# EAGLE design NixieClock (EAGLE 6.6.0)
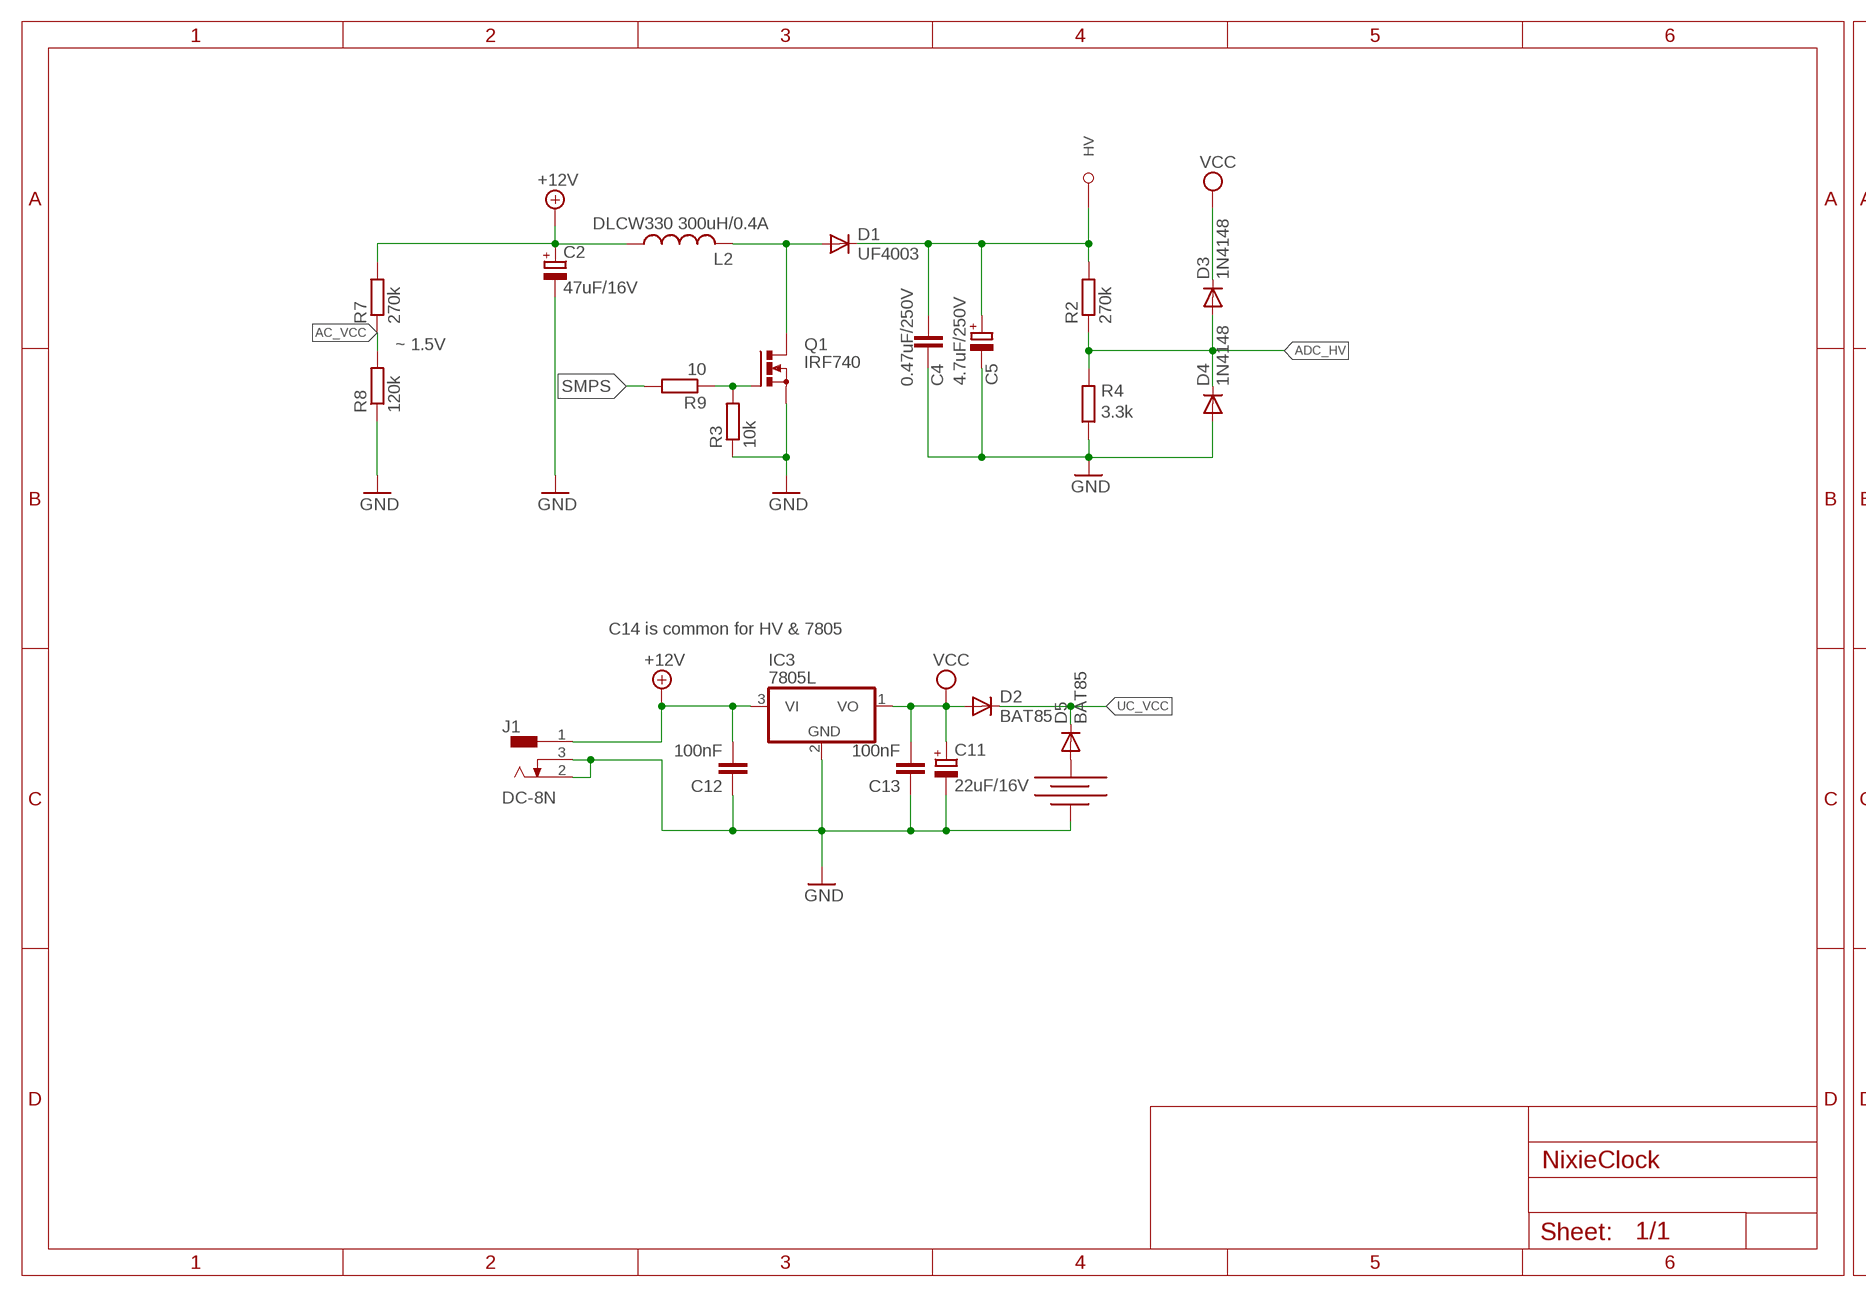
[diagram p0: schematic, sheet 1, part 1 of 2]
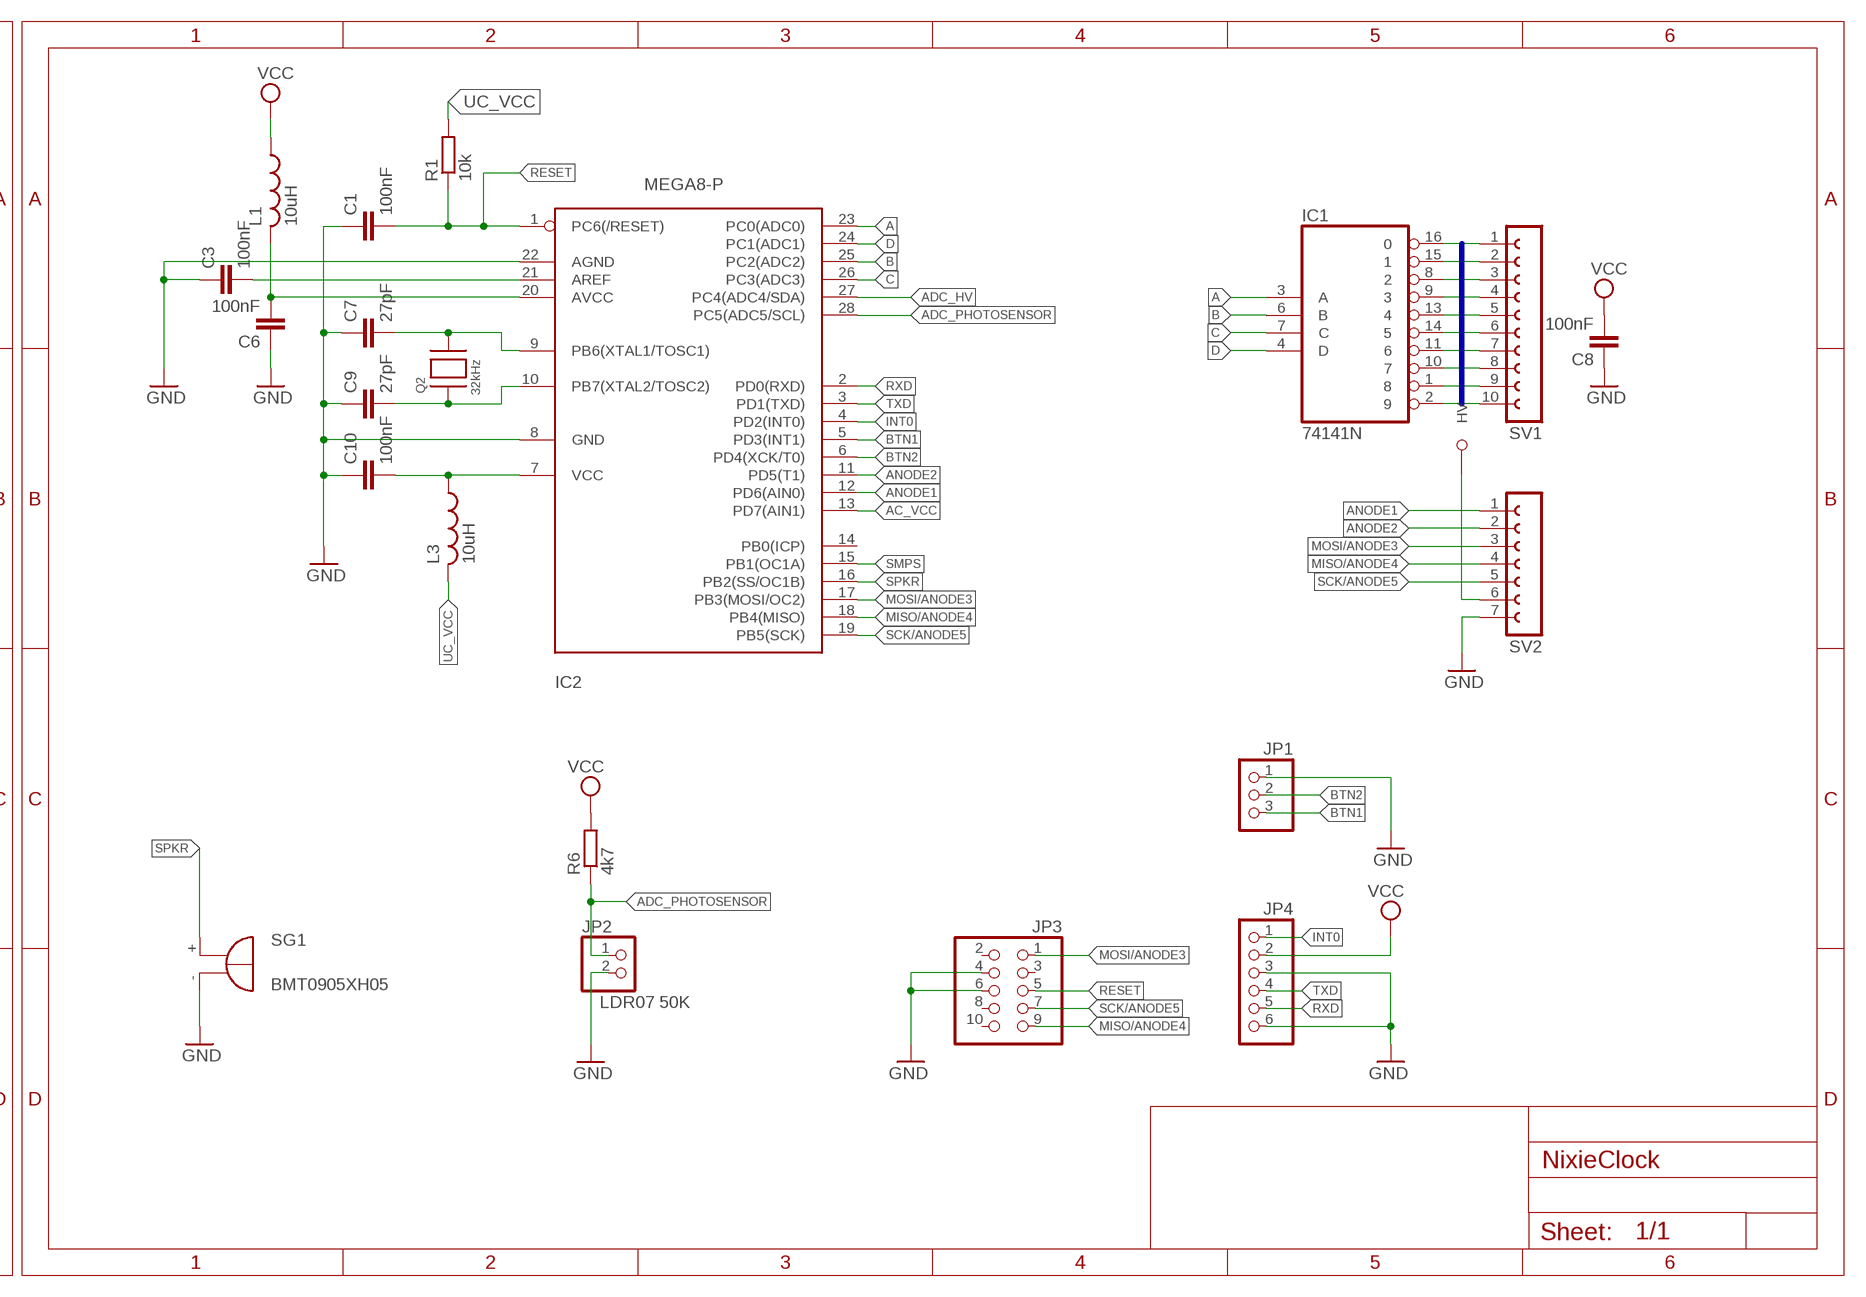
[diagram p1: schematic, sheet 1, part 2 of 2]

## Parts
C1  100nF  C-EU025-025X050  [C025-025X050]
C2  47uF/16V  CPOL-EUE2.5-7  [E2,5-7]
C3  100nF  C-EU025-025X050  [C025-025X050]
C4  0.47uF/250V  C10/6  [C10B6]
C5  4.7uF/250V  CPOL-EU  [CAP_RADIAL]
C6  100nF  C-EU025-025X050  [C025-025X050]
C7  27pF  C-EU025-025X050  [C025-025X050]
C8  100nF  C-EU050-025X075  [C050-025X075]
C9  27pF  C-EU025-025X050  [C025-025X050]
C10  100nF  C-EU025-025X050  [C025-025X050]
C11  22uF/16V  CPOL-EUE2.5-6  [E2,5-6]
C12  100nF  C-EU025-025X050  [C025-025X050]
C13  100nF  C-EU025-025X050  [C025-025X050]
D1  UF4003  [DO41-10]
D2  BAT85  1N4148DO35-7  [DO35-7]
D3  1N4148  1N4148DO35-7  [DO35-7]
D4  1N4148  1N4148DO35-7  [DO35-7]
D5  BAT85  1N4148DO35-7  [DO35-7]
IC1  74141N  [DIL16]
IC2  MEGA8-P  [DIL28-3]
IC3  7805L  [TO92]
J1  DC-8N  [DC-8N]
JP1  PINHD-1X3/90  [1X03/90]
JP2  LDR07 50K  PINHD-1X2  [1X02]
JP3  PINHD-2X5/90  [2X05/90]
JP4  PINHD-1X6/90  [1X06/90]
L1  10uH  L-US0204/7  [0204/7]
L2  DLCW330 300uH/0.4A  RADIAL-CHOKE4MM  [MURATA-CHOKE-7-4]
L3  10uH  L-US0204/5  [0204/5]
Q1  IRF740  PMOSFET_NTO220BH  [TO220BH]
Q2  32kHz  XTAL  [QS]
R1  10k  R-EU_0207/12  [0207/12]
R2  270k  R-EU_0204/5  [0204/5]
R3  10k  R-EU_0204/5  [0204/5]
R4  3.3k  R-EU_0204/5  [0204/5]
R6  4k7  R-EU_0204/5  [0204/5]
R7  270k  R-EU_0204/5  [0204/5]
R8  120k  R-EU_0204/5  [0204/5]
R9  10  R-EU_0204/5  [0204/5]
SG1  BMT0905XH05  [BMT0905XH05]
SV1  FE10-1  [FE10]
SV2  FE07-1  [FE07]
U$3  BAT1220THT  [1220]

## Nets
+12V: C2.+ C12.2 IC3.3(VI) J1.1 L2.P$1 R7.2
A: IC1.3(A) IC2.23(PC0(ADC0))
AC_VCC: IC2.13(PD7(AIN1)) R7.1 R8.2
ADC_HV: D3.A D4.C IC2.27(PC4(ADC4/SDA)) R2.1 R4.2
ADC_PHOTOSENSOR: IC2.28(PC5(ADC5/SCL)) JP2.1 R6.1
ANODE1: IC2.12(PD6(AIN0)) SV2.1
ANODE2: IC2.11(PD5(T1)) SV2.2
B: IC1.6(B) IC2.25(PC2(ADC2))
BTN1: IC2.5(PD3(INT1)) JP1.3
BTN2: IC2.6(PD4(XCK/T0)) JP1.2
C: IC1.7(C) IC2.26(PC3(ADC3))
D: IC1.4(D) IC2.24(PC1(ADC1))
D1: IC1.2 SV1.1
D2: IC1.1 SV1.2
D3: IC1.16 SV1.3
D4: IC1.15 SV1.4
D5: IC1.14 SV1.5
D6: IC1.13 SV1.6
D7: IC1.11 SV1.7
D8: IC1.10 SV1.8
D9: IC1.9 SV1.9
D10: IC1.8 SV1.10
GND: C1.1 C2.- C3.1 C4.2 C5.P$4(-) C6.1 C7.1 C8.1 C9.1 C10.1 C11.- C12.1 C13.1 D4.A IC2.8(GND) IC2.22(AGND) IC3.2(GND) J1.2 J1.3 JP1.1 JP2.2 JP3.4 JP3.6 JP4.3 JP4.6 Q1.S R3.1 R4.1 R8.1 SG1.- SV2.7 U$3.-
HV: C4.1 C5.P$3(+) D1.C R2.2 SV2.6
INT0: IC2.4(PD2(INT0)) JP4.1
MISO/ANODE4: IC2.18(PB4(MISO)) JP3.9 SV2.4
MOSI/ANODE3: IC2.17(PB3(MOSI/OC2)) JP3.1 SV2.3
N$1: C7.2 IC2.9(PB6(XTAL1/TOSC1)) Q2.P$2
N$2: C9.2 IC2.10(PB7(XTAL2/TOSC2)) Q2.P$1
N$3: D5.A U$3.+
N$4: Q1.G R3.2 R9.1
N$9: C6.2 IC2.20(AVCC) L1.2
N$10: C10.2 IC2.7(VCC) L3.1
N$11: C3.2 IC2.21(AREF)
N$16: D1.A L2.P$2 Q1.D
RESET: C1.2 IC2.1(PC6(/RESET)) JP3.5 R1.1
RXD: IC2.2(PD0(RXD)) JP4.5
SCK/ANODE5: IC2.19(PB5(SCK)) JP3.7 SV2.5
SMPS: IC2.15(PB1(OC1A)) R9.2
SPKR: IC2.16(PB2(SS/OC1B)) SG1.+
TXD: IC2.3(PD1(TXD)) JP4.4
UC_VCC: D2.C D5.C L3.2 R1.2
VCC: C8.2 C11.+ C13.2 D2.A D3.C IC3.1(VO) JP4.2 L1.1 R6.2
Unconnected: IC2.14(PB0(ICP)) JP3.2 JP3.3 JP3.8 JP3.10

## Buses
D[1..10]

## Notes on the sheet
- ~ 1.5V
- C14 is common for HV & 7805

## Power pins joined to a net without a drawn wire
GND: IC1.12(GND)
VCC: IC1.5(VCC)

## Library data of the parts
C1 C3 C6-C10 C12 C13 = rcl:C-EU: CAPACITOR, European symbol
C2 C11 = rcl:CPOL-EU: POLARIZED CAPACITOR, European symbol
C4 = capacitor-wima:C: CAPACITOR naming: grid - package width
C5 = Various:CPOL-EU: POLARIZED CAPACITOR, European symbol
D1 = diode:UF4003: DIODE ultrafast recovery diode, 200 V rectifier
D2-D5 = diode:1N4148: DIODE high speed (Philips)
IC1 = 74xx-eu:74*141: BCD to decimal DECODER/DRIVER
IC2 = atmel:MEGA8-P: MICROCONTROLLER 8 Kbytes FLASH 1 kbytes SRAM 512 bytes EEPROM USART 4-channel 10 bit ADC 2-channel 8 bit ADC Source: avr.lbr
IC3 = linear:78*: Positive VOLTAGE REGULATOR Source: http://cache.national.com/ds/LM/LM78L05.pdf http://www.fairchildsemi.com/ds/LM/LM7805.pdf
J1 = con-jack-2:DC-8N: DC-8N NARROW DC POWER SOCKET Source: FC681455.pdf; OC_FARNELL: unknown; OC_NEWARK: unknown; OC_TME: FC681455
JP1 = pinhead:PINHD-1X3: PIN HEADER
JP2 = pinhead:PINHD-1X2: PIN HEADER
JP3 = pinhead:PINHD-2X5: PIN HEADER
JP4 = pinhead:PINHD-1X6: PIN HEADER
L1 L3 = rcl:L-US: INDUCTOR, American symbol
L2 = WB:RADIAL-CHOKE: Murata Power Solutions
Q1 = transistor-power:PMOSFET_N: Power MOSFET N-Channel
Q2 = Various:XTAL
R1-R4 R6-R9 = rcl:R-EU_: RESISTOR, European symbol
SG1 = Various:BMT0905XH05: MAGNETIC TRANSDUCER Source: Http:www.be-star.com; OC_FARNELL: unknown; OC_NEWARK: unknown
SV1 = con-lsta:FE10-1: FEMALE HEADER; OC_FARNELL: unknown; OC_NEWARK: unknown
SV2 = con-lsta:FE07-1: FEMALE HEADER; OC_FARNELL: unknown; OC_NEWARK: unknown
U$3 = WB:BAT1220THT: Based on CH23-1220LF drawing

## Board
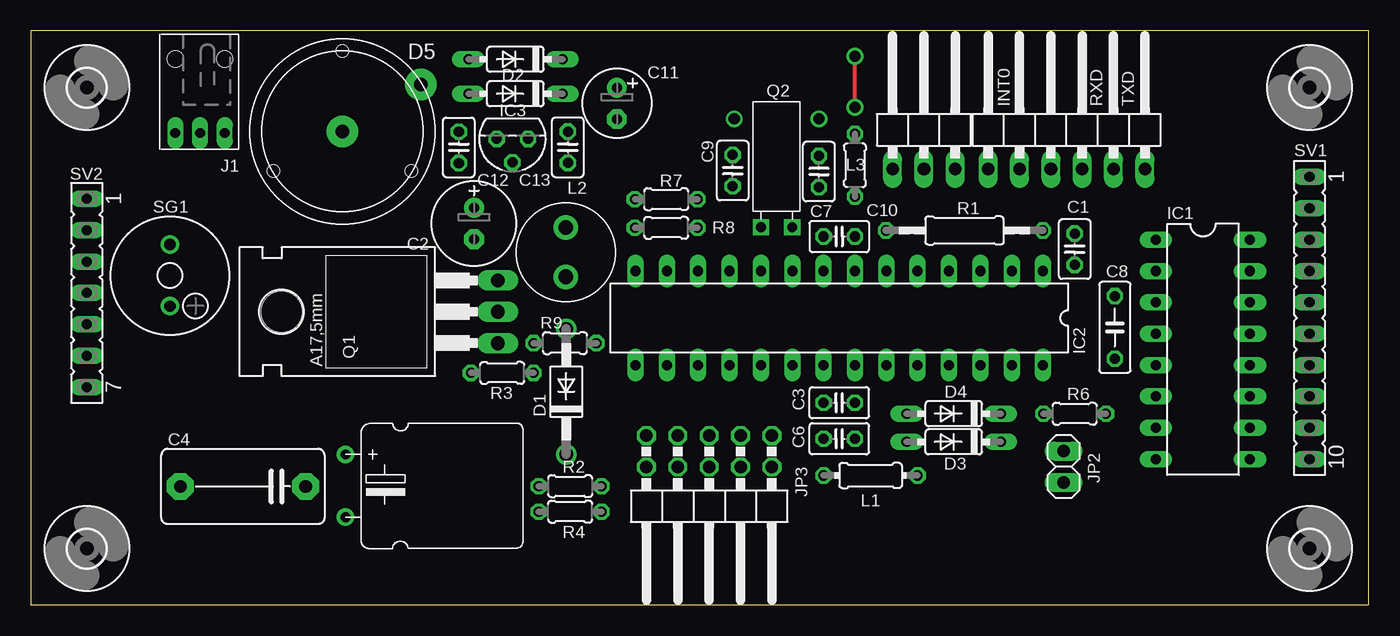
[diagram p2: board, top side]
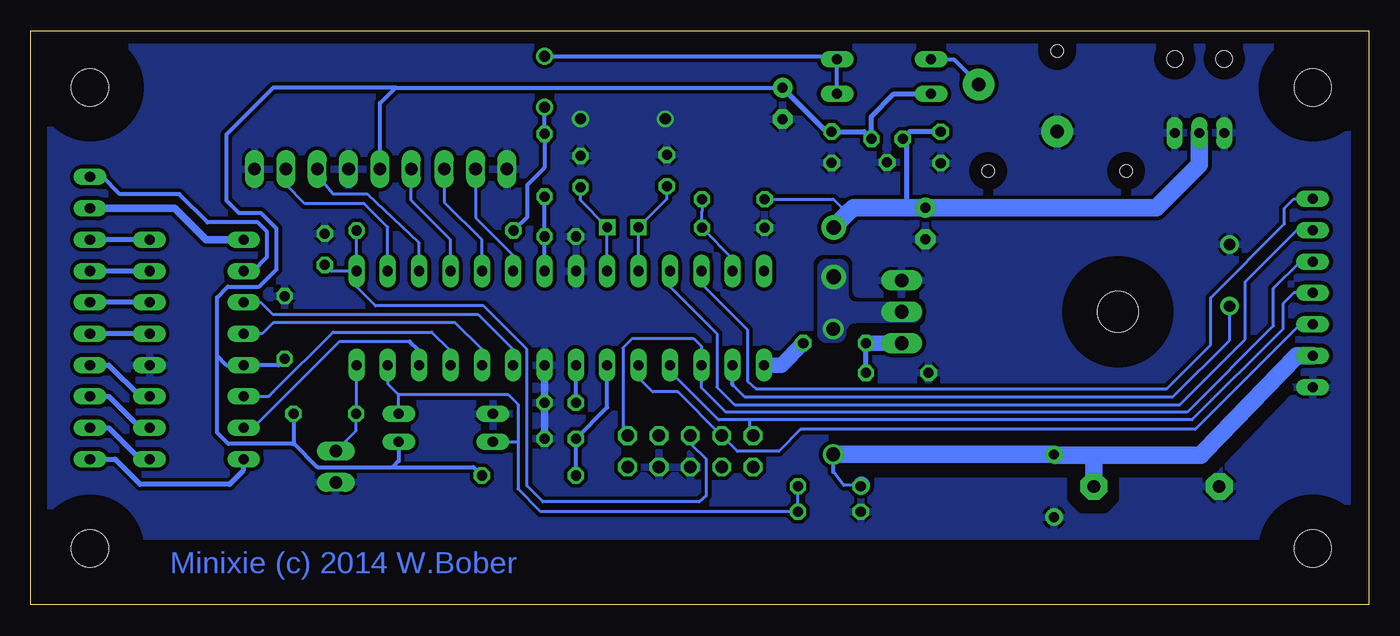
[diagram p3: board, bottom side, seen from below]

Size 108.38 x 46.49 mm. Coordinates in mm from the lower left corner, seen from the top.
Outline: 0,0 108.38,0 108.38,46.49 0,46.49 0,0
Copper layers (1*16): Top 0.035mm / dielectric 1.5mm / Bottom 0.035mm
Design rules "default": minimum track width 10mil, minimum drill 24mil, track to track 12mil, track to pad 12mil, pad to pad 12mil, via to via 12mil, smd to smd 8mil, copper to edge 40mil, drill to drill 8mil, minimum pad ring 10mil, minimum via ring 8mil, stop-mask expansion 4mil, vias tented up to drill 0mil, thermal gap 10mil
bRestrict: 8 lines

### Footprints (pad centres in the part's own frame; a part is rotated, then mirrored left to right if it is on the bottom)
C025-025X050 = drill 0.813 octagon: 1 -1.27,0; 2 1.27,0
E2,5-7 = drill 0.813 pad 1.6: + -1.27,0 | drill 0.813 pad 1.6 octagon: - 1.27,0
C10B6 = drill 1.016 pad 2.159 octagon: 1 -5.08,0; 2 5.08,0
CAP_RADIAL = drill 0.8 pad 1.422: P$3 0,-2.54; P$4 0,2.54
C050-025X075 = drill 0.813 octagon: 1 -2.54,0; 2 2.54,0
E2,5-6 = drill 0.813 pad 1.6: + -1.27,0 | drill 0.813 pad 1.6 octagon: - 1.27,0
DO41-10 = drill 1.118: A 5.08,0; C -5.08,0
DO35-7 = drill 0.813 long: A 3.81,0; C -3.81,0
DIL16 = drill 0.813 long: 1 -8.89,-3.81; 2 -6.35,-3.81; 3 -3.81,-3.81; 4 -1.27,-3.81; 5 1.27,-3.81; 6 3.81,-3.81; 7 6.35,-3.81; 8 8.89,-3.81; 9 8.89,3.81; 10 6.35,3.81; 11 3.81,3.81; 12 1.27,3.81; 13 -1.27,3.81; 14 -3.81,3.81; 15 -6.35,3.81; 16 -8.89,3.81
DIL28-3 = drill 0.813 long: 1 -16.51,-3.81; 2 -13.97,-3.81; 3 -11.43,-3.81; 4 -8.89,-3.81; 5 -6.35,-3.81; 6 -3.81,-3.81; 7 -1.27,-3.81; 8 1.27,-3.81; 9 3.81,-3.81; 10 6.35,-3.81; 11 8.89,-3.81; 12 11.43,-3.81; 13 13.97,-3.81; 14 16.51,-3.81; 15 16.51,3.81; 16 13.97,3.81; 17 11.43,3.81; 18 8.89,3.81; 19 6.35,3.81; 20 3.81,3.81; 21 1.27,3.81; 22 -1.27,3.81; 23 -3.81,3.81; 24 -6.35,3.81; 25 -8.89,3.81; 26 -11.43,3.81; 27 -13.97,3.81; 28 -16.51,3.81
TO92 = drill 0.813 octagon: 1 -1.27,0; 2 0,1.905; 3 1.27,0
DC-8N = drill 0.8 pad 1.3 long: 1 3.15,8; 2 1.15,8; 3 5.15,8 | hole 1.3: 1.15,2; 5.15,2
1X03/90 = drill 1.016 long: 1 -2.54,-3.81; 2 0,-3.81; 3 2.54,-3.81
1X02 = drill 1.016 long: 1 -1.27,0; 2 1.27,0
2X05/90 = drill 1.016 octagon: 1 -5.08,-6.35; 2 -5.08,-3.81; 3 -2.54,-6.35; 4 -2.54,-3.81; 5 0,-6.35; 6 0,-3.81; 7 2.54,-6.35; 8 2.54,-3.81; 9 5.08,-6.35; 10 5.08,-3.81
1X06/90 = drill 1.016 long: 1 -6.35,-3.81; 2 -3.81,-3.81; 3 -1.27,-3.81; 4 1.27,-3.81; 5 3.81,-3.81; 6 6.35,-3.81
0204/7 = drill 0.813 octagon: 1 -3.81,0; 2 3.81,0
MURATA-CHOKE-7-4 = drill 1.2 pad 2: P$1 -2,0; P$2 2,0
0204/5 = drill 0.813 octagon: 1 -2.54,0; 2 2.54,0
TO220BH = drill 1.118 long: D 0,-6.35; G -2.54,-6.35; S 2.54,-6.35 | hole 3.302: 0,11.176
QS = drill 0.8 square: P$1 0.635,-1.27; P$2 3.175,-1.27
0207/12 = drill 0.813 octagon: 1 -6.35,0; 2 6.35,0
BMT0905XH05 = drill 0.9 pad 1.5: + 2.47,0; - -2.53,0
FE10 = drill 0.813 long: 1 -11.43,0; 2 -8.89,0; 3 -6.35,0; 4 -3.81,0; 5 -1.27,0; 6 1.27,0; 7 3.81,0; 8 6.35,0; 9 8.89,0; 10 11.43,0
FE07 = drill 0.813 long: 1 -7.62,0; 2 -5.08,0; 3 -2.54,0; 4 0,0; 5 2.54,0; 6 5.08,0; 7 7.62,0
1220 = drill 1.1 pad 2.54: + -6.35,-3.81; - 0,0 | hole 1: 0,-6.5; -5.6,3.2; 5.6,3.2
3,0 = hole 3: 0,0

### Placement (x,y rotation side)
C1  84.57,28.81 270 top
C2  35.9,30.89 270 top
C3  65.49,16.38 180 top
C4  17.18,9.6 180 top
C5  25.49,9.65 180 top
C6  65.49,13.46 180 top
C7  63.84,35.1 270 top
C8  87.82,22.47 270 top
C9  56.86,35.17 270 top
C10  65.49,29.84 0 top
C11  47.48,40.62 270 top
C12  34.67,37.06 90 top
C13  43.51,37.07 90 top
D1  43.38,17.27 90 top
D2  39.26,41.4 180 top
D3  74.77,13.2 180 top
D4  74.77,15.49 180 top
D5  39.26,44.19 180 top
IC1  94.96,20.7 270 top
IC2  65.49,23.24 180 top
IC3  39.02,37.74 180 top
J1  16.85,46.22 180 top
JP1  72.35,39.11 0 top
JP2  83.68,11.2 270 top
JP3  54.95,7.36 180 top
JP4  83.91,39.11 0 top
L1  68.03,10.49 180 top
L2  43.35,28.57 270 top
L3  66.76,35.61 90 top
Q1  31.48,23.74 90 top
Q2  58.51,31.87 0 top
R1  75.63,30.33 180 top
R2  43.69,9.62 180 top
R3  38.19,18.79 0 top
R4  43.69,7.56 0 top
R6  84.57,15.49 0 top
R7  51.47,32.86 180 top
R8  51.47,30.54 0 top
R9  43.27,21.2 0 top
SG1  11.27,26.66 270 top
SV1  103.59,23.24 270 top
SV2  4.53,25.27 270 top
U$3  25.24,38.35 180 top
U$5  [3,0]  103.59,4.57 0 top
U$6  [3,0]  103.59,41.91 0 top
U$7  [3,0]  4.53,41.91 0 top
U$8  [3,0]  4.53,4.57 0 top

### Tracks (layer width: path | path; a pad name or v marks a point on that pad's centre or on a via)
+12V
  Bottom 0.254: R7.2 43.37,32.86 42.21,31.7
  Bottom 0.406: C12.2 37.16,38.33 IC3.3 37.43,37.74 37.43,32.16
  Bottom 1.422: L2.P$1 42.21,31.7 41.76,32.16 37.43,32.16 C2.+ 17.2,32.16 13.7,35.66 J1.1
A
  Bottom 0.254: IC2.23 69.3,20.7 72.15,23.54 88.79,23.54 89.75,24.51 IC1.3
AC_VCC
  Bottom 0.254: R7.1 54.01,31.87 54.01,31.74 | 54.01,31.74 54.01,31.62 R8.2 51.52,28.05 IC2.13 | 54.01,31.74
ADC_HV
  Bottom 0.254: R2.1 R4.2 67.09,7.56 68.92,9.39 68.92,13.2 | R2.1 | 68.92,13.2 68.92,16.25 69.69,17.01 78.58,17.01 | IC2.27 79.46,17.9 78.58,17.01 | D4.C 78.58,17.01 | D3.A 68.92,13.2
ADC_PHOTOSENSOR
  Bottom 0.254: IC2.28 82.03,19.4 R6.1 82.03,14.12 JP2.1
ANODE1
  Bottom 0.254: IC2.12 54.06,26.03 50.31,22.27 50.31,18.11 49.62,17.52 16.35,17.52 12.79,21.08 12.79,24.89 6.82,30.86 6.82,32.13 6.06,32.89 SV2.1
ANODE2
  Bottom 0.254: IC2.11 56.6,25.78 52.79,21.97 52.79,17.65 51.37,16.23 15.3,16.23 10,21.53 10,26.16 5.8,30.35 SV2.2
B
  Bottom 0.254: 74.38,20.57 75.91,22.09 83.91,22.09 88.74,17.27 88.99,17.01 89.12,16.89 IC1.6
  Bottom 0.305: IC2.25 74.38,20.57
BTN1
  Bottom 0.254: JP1.3 74.89,32.63 71.84,29.59 IC2.5
BTN2
  Bottom 0.254: JP1.2 72.35,31.36 69.3,28.32 IC2.6
C
  Bottom 0.254: 77.69,21.33 83.4,21.33 90.39,14.35 IC1.7
  Bottom 0.305: IC2.26 76.92,20.57 77.69,21.33
D
  Bottom 0.254: IC2.24 71.84,20.7 74,22.86 88.74,22.86 89.62,21.97 IC1.4
  Bottom 0.406: IC2.24 71.84,19.68
D1
  Bottom 0.305: 90.39,27.05 89.24,28.19 89.24,30.22 90.01,30.98 94.07,30.98 96.36,33.27 101.18,33.27 102.58,34.67 SV1.1
  Bottom 0.406: 90.39,27.05 IC1.2
D2
  Bottom 0.61: IC1.1 94.2,29.59 96.74,32.13 SV1.2
D3
  Bottom 0.406: IC1.16 SV1.3
D4
  Bottom 0.406: IC1.15 SV1.4
D5
  Bottom 0.406: IC1.14 SV1.5
D6
  Bottom 0.406: IC1.13 SV1.6
D7
  Bottom 0.406: SV1.7 102.07,19.43 99.53,16.89 IC1.11
D8
  Bottom 0.406: SV1.8 102.07,16.89 99.53,14.35 IC1.10
D9
  Bottom 0.406: SV1.9 102.07,14.35 99.53,11.81 IC1.9
D10
  Bottom 0.406: IC1.8 91.15,10.92 92.29,9.77 99.53,9.77 101.56,11.81 SV1.10
GND  (via drill 0.9)
  Bottom 0.61: IC2.22 C3.1 C6.1
  other vias: 56.99,39.37 63.84,39.37
  pour Bottom (isolate 0.305, rank 2): 106.77,46.22 1.74,46.22 1.74,5.58 106.77,5.58
  pour Bottom: 101.69,31.24 105.25,31.24 105.25,30.48 101.69,30.48
  pour Bottom: 81.62,32 80.35,30.73 80.86,30.22 82.13,31.49
  pour Bottom: 76.04,37.08 76.04,33.78 76.54,33.78 76.54,37.08
HV
  Bottom 0.254: 41.09,9.68 42.54,9.68 43.38,10.77
  Bottom 0.305: 43.38,10.77 D1.C
  Bottom 1.422: SV2.6 5.8,20.19 13.43,12.31 | 41.09,9.68 R2.2 | 13.43,12.31 13.55,12.19 | 13.43,12.31 13.61,12.14 22.19,12.14 | 22.19,12.14 25.44,12.14 C5.P$3 42.86,12.19 D1.C | C4.1 22.26,12.06 22.19,12.14
INT0
  Bottom 0.254: IC2.4 74.38,29.59 77.56,32.76 JP4.1
MISO/ANODE4
  Bottom 0.254: 50.13,14.98 14.31,14.98 6.95,22.35 6.95,24.38 6.06,25.27 SV2.4 | 50.13,14.98 52.67,14.98 56.6,18.92 IC2.18 | 50.13,14.98 50.13,13.96 JP3.9
MOSI/ANODE3
  Bottom 0.254: SV2.3 5.55,27.81 7.71,25.65 7.71,22.6 14.69,15.62 52.08,15.62 54.06,17.6 IC2.17 54.06,20.95 54.7,21.59 59.65,21.59 60.41,20.82 60.41,14.09 JP3.1
N$1
  Bottom 0.254: IC2.9 Q2.P$2 63.84,32.76 C7.2
N$2
  Bottom 0.254: IC2.10 Q2.P$1 56.86,32.89 C9.2
N$3
  Bottom 0.305: D5.A 33.62,44.19 U$3.+
N$4
  Bottom 0.406: R3.2 R9.1
  Bottom 1.27: R9.1 Q1.G
N$9
  Bottom 0.305: IC2.20 61.68,16 C6.2 L1.2
N$10
  Bottom 0.305: IC2.7 C10.2 L3.1
N$11
  Bottom 0.305: C3.2 IC2.21
N$16
  pour Bottom (no thermals): 43.9,27.94 42.89,27.94 arc90 42.25,27.3 42.25,25.14 arc-90 41.59,24.48 36.97,24.48 arc90 36.34,23.85 36.34,23.57 arc90 36.97,22.93 41.57,22.93 arc-90 42.46,22.04 42.46,21.97 arc90 43.09,21.33 43.9,21.33 arc90 44.54,21.97 44.54,27.3 arc90
RESET
  Bottom 0.254: IC2.1 82,25.78 80.46,24.23 71.69,24.23 68.19,20.72 68.19,9.65 66.89,8.35 54.24,8.35 53.66,8.88 53.66,11.78 54.95,13.08 JP3.5 | IC2.1 82,30.2 R1.1 | IC2.1 84.07,27.05 C1.2
RXD
  Bottom 0.254: IC2.2 79.46,30.6 81.37,32.51 86.2,32.51 87.72,34.03 JP4.5
SCK/ANODE5
  Bottom 0.254: IC2.19 59.14,18.41 58,17.27 55.97,17.27 JP3.7 51.14,12.44 47.79,12.44 46.01,14.22 14.06,14.22 5.55,22.73 SV2.5
SMPS
  Bottom 1.27: IC2.15 47.59,19.43 R9.2
SPKR
  Bottom 0.254: 51.52,17.83 50.53,16.84 15.89,16.84 11.27,21.46 SG1.+ 11.27,24.13
  Bottom 0.305: 51.52,17.83 IC2.16
TXD
  Bottom 0.254: IC2.3 76.92,29.33 81.12,33.27 83.91,33.27 85.18,34.79 JP4.4
UC_VCC  (via drill 0.9)
  Top 0.305: v66.76,40.3 v66.76,44.45
  Bottom 0.305: v66.76,44.45 43.32,44.45 D5.C D2.C | R1.2 68.16,31.45 68.16,34.03 66.76,35.43 L3.2 v66.76,40.3 | v66.76,40.3
VCC
  Bottom 0.305: 93.31,20.19 92.55,19.43 IC1.5 88.33,19.43 | 93.31,20.19 93.31,24.89 92.42,25.78 89.88,25.78 88.48,27.17 88.48,30.48 89.75,31.74 91.53,31.74 92.55,32.76 92.55,38.09 88.74,41.91 78.83,41.91 | 93.31,20.19 93.31,13.96 92.39,13.05 87.21,13.05 | 78.83,41.91 47.5,41.91 C11.+ | JP4.2 80.1,40.63 78.83,41.91 | 87.21,13.05 87.06,13.05 85.18,11.17 79.08,11.17 | 79.08,11.17 72.53,11.17 L1.1 | D3.C 78.58,11.68 79.08,11.17 | R6.2 87.11,13.15 87.21,13.05
  Bottom 0.406: D2.A 38.44,41.4 40.29,39.55 IC3.1 40.88,38.34 C13.2 43.93,38.34 C11.+ | C8.2 88.33,19.43

### Text on the board
Bottom: Minixie (c) 2014 W.Bober
tNames: INT0 | RXD | TXD
tDocu: GND | BTN2 | BTN1 | VCC | GND | GND